# Altium schematic sheet gpio_expander.SchDoc
size A
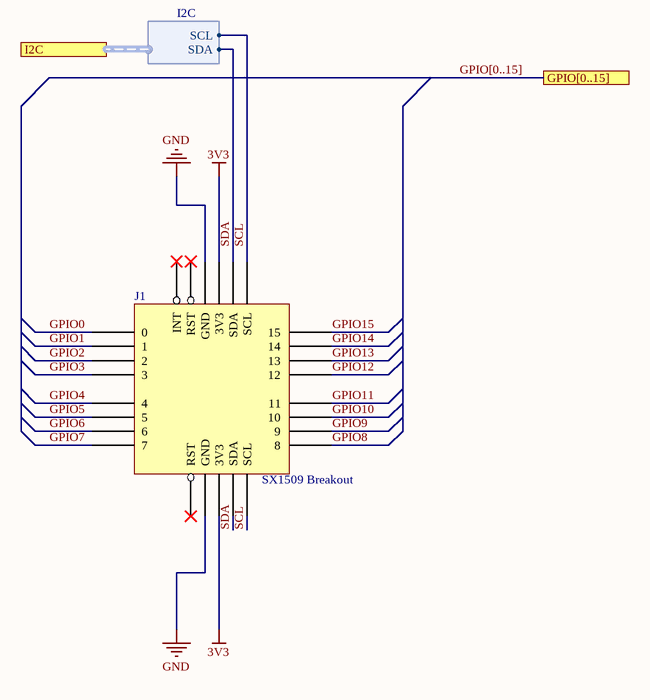
[diagram p0: gpio_expander.SchDoc]

## Parts
J1  SX1509 Breakout  [SX1509 Breakout]

## Ports
GPIO[0..15], I2C (harness I2C)

## Harnesses
I2C: SCL, SDA

## Nets
3V3: J1.11(3V3) J1.24(3V3)
GND: J1.10(GND) J1.25(GND)
GPIO0: J1.1(0)
GPIO1: J1.2(1)
GPIO2: J1.3(2)
GPIO3: J1.4(3)
GPIO4: J1.5(4)
GPIO5: J1.6(5)
GPIO6: J1.7(6)
GPIO7: J1.8(7)
GPIO8: J1.14(8)
GPIO9: J1.15(9)
GPIO10: J1.16(10)
GPIO11: J1.17(11)
GPIO12: J1.18(12)
GPIO13: J1.19(13)
GPIO14: J1.20(14)
GPIO15: J1.21(15)
SCL: J1.13(SCL) J1.22(SCL) ; port I2C.SCL
SDA: J1.12(SDA) J1.23(SDA) ; port I2C.SDA

Not connected (* = marked no-connect by the designer): J1 9(RST)* 26(RST)* 27(INT)*

## Buses and harness runs
bus GPIO[0..15] = port GPIO[0..15]